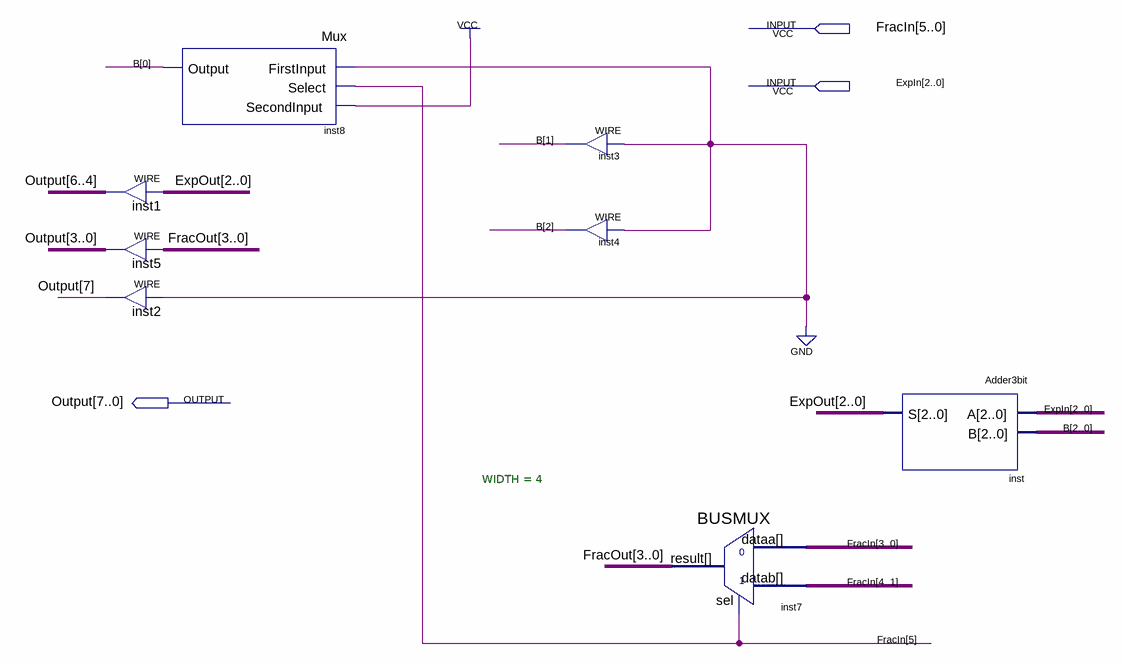
[diagram p0: schematic sheet]
// Quartus schematic N.bdf as structural Verilog: 8 symbols, 3 pins
module N (
  input  [5:0] FracIn,
  input  [2:0] ExpIn,
  output [7:0] Output
);

  wire [2:0] B, ExpOut;
  wire [3:0] FracOut;

  assign Output[6:4] = ExpOut;  // WIRE inst1
  assign Output[3:0] = FracOut;  // WIRE inst5
  assign Output[7] = 1'b0;  // WIRE inst2
  Mux inst8 (.FirstInput(1'b0), .Select(FracIn[5]), .SecondInput(1'b1), .Output(B[0]));
  assign B[1] = 1'b0;  // WIRE inst3
  assign B[2] = 1'b0;  // WIRE inst4
  BUSMUX #(.WIDTH(4)) inst7 (.datab(FracIn[4:1]), .sel(FracIn[5]), .dataa(FracIn[3:0]), .result(FracOut));
  Adder3bit inst (.A(ExpIn), .B(B), .S(ExpOut));
endmodule
